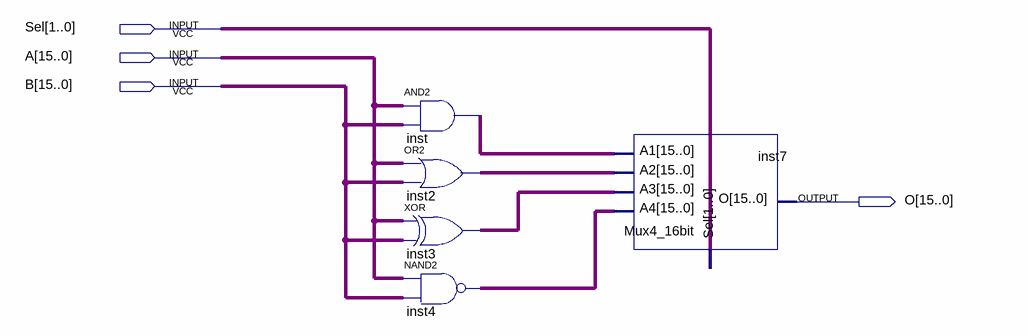
[diagram p0: schematic sheet]
// Quartus schematic Not_ALU2.bdf as structural Verilog: 5 symbols, 4 pins
module Not_ALU2 (
  input  [1:0] Sel,
  input  [15:0] A,
  input  [15:0] B,
  output [15:0] O
);

  wire [15:0] inst2_out, inst3_out, inst4_out, inst_out;

  assign inst_out = A & B;  // AND2 inst, 16 bits wide
  assign inst2_out = A | B;  // OR2 inst2, 16 bits wide
  assign inst3_out = A ^ B;  // XOR inst3, 16 bits wide
  assign inst4_out = ~(A & B);  // NAND2 inst4, 16 bits wide
  Mux4_16bit inst7 (.Sel(Sel), .A4(inst4_out), .A3(inst3_out), .A2(inst2_out), .A1(inst_out), .O(O));
endmodule
